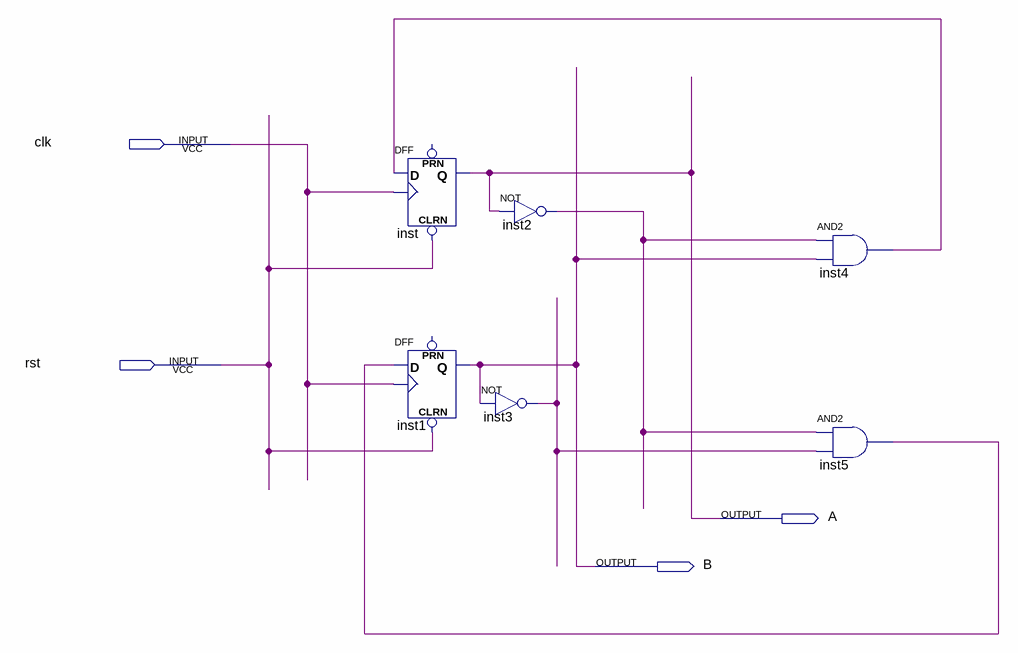
[diagram p0: schematic sheet]
// Quartus schematic count_3.bdf as structural Verilog: 6 symbols, 4 pins
module count_3 (
  input  clk,
  input  rst,
  output A,
  output B
);

  wire inst2_out, inst3_out, inst4_out, inst5_out;

  DFF inst (.CLRN(rst), .CLK(clk), .D(inst4_out), .Q(A));  // open: PRN
  DFF inst1 (.CLRN(rst), .CLK(clk), .D(inst5_out), .Q(B));  // open: PRN
  not inst3 (inst3_out, B);
  not inst2 (inst2_out, A);
  and inst4 (inst4_out, inst2_out, B);
  and inst5 (inst5_out, inst2_out, inst3_out);
endmodule
